# Altium schematic sheet MercurialSDR_FPGA_BNK.SchDoc: MercurialSDR - iCE Banks
size A4; Author: Andres Hojnadel; DrawnBy: Andres Hojnadel; Revision: Rev2.0; SheetNumber: 5; SheetTotal: 6; ProjectName: MercurialSDR
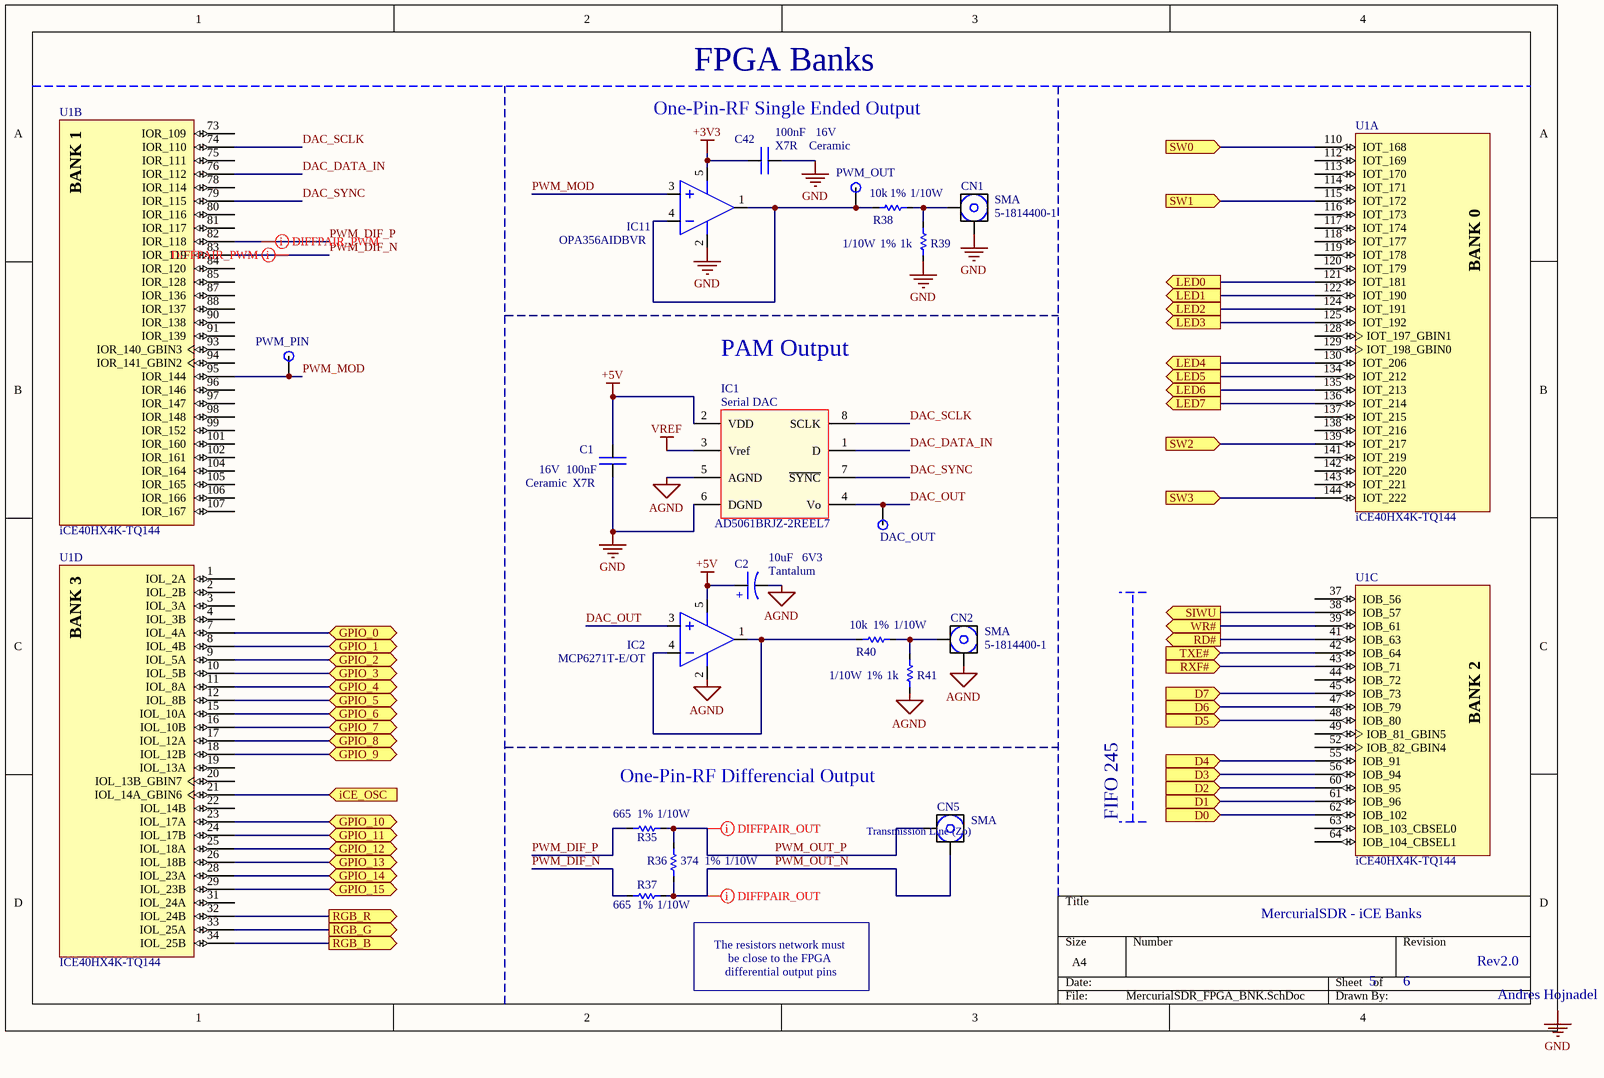
[diagram p0: MercurialSDR_FPGA_BNK.SchDoc]

## Parts
C1  value 100nF  Temp Coef: X7R  VR: 16V  Material: Ceramic  [CAP_0603]  (hidden comment: Capacitor)
C2  value 10uF  VR: 6V3  Material: Tantalum  [CAP_TANT_1206]  (hidden comment: Capacitor Polarizado)
C42  value 100nF  Temp Coef: X7R  VR: 16V  Material: Ceramic  [CAP_0603]  (hidden comment: Capacitor)
CN1  SMA  Part Number: 5-1814400-1  [SMA_Connector]
CN2  SMA  Part Number: 5-1814400-1  [SMA_Connector]
CN5  SMA  [SMA_Connector]
IC1  Serial DAC  Part Number: AD5061BRJZ-2REEL7  [SOT-23-8]
IC2  Part Number: MCP6271T-E/OT  [SOT-23-5]  (hidden comment: OPAMP)
IC11  Part Number: OPA356AIDBVR  [SOT-23-5_2]  (hidden comment: OPAMP)
R35  value 665  Power: 1/10W  Tolerance: 1%  [RES_0603]  (hidden comment: Resistor SMD)
R36  value 374  Power: 1/10W  Tolerance: 1%  [RES_0603]  (hidden comment: Resistor SMD)
R37  value 665  Power: 1/10W  Tolerance: 1%  [RES_0603]  (hidden comment: Resistor SMD)
R38  value 10k  Power: 1/10W  Tolerance: 1%  [RES_0603]  (hidden comment: Resistor SMD)
R39  value 1k  Power: 1/10W  Tolerance: 1%  [RES_0603]  (hidden comment: Resistor SMD)
R40  value 10k  Power: 1/10W  Tolerance: 1%  [RES_0603]  (hidden comment: Resistor SMD)
R41  value 1k  Power: 1/10W  Tolerance: 1%  [RES_0603]  (hidden comment: Resistor SMD)
TP1  TP Name: PWM_PIN  [TP_TOP]  (hidden comment: Test Point)
TP2  TP Name: DAC_OUT  [TP_TH]  (hidden comment: Test Point)
TP5  TP Name: PWM_OUT  [TP_TH]  (hidden comment: Test Point)
U1  iCE40HX4K-TQ144  [LATC-TQFP-144_L]  (parts A,B,C,D of 6)

## Ports
D0 (in), D1 (in), D2 (in), D3 (in), D4 (in), D5 (in), D6 (in), D7 (in), GPIO_0 (bidir), GPIO_1 (bidir), GPIO_2 (bidir), GPIO_3 (bidir), GPIO_4 (bidir), GPIO_5 (bidir), GPIO_6 (bidir), GPIO_7 (bidir), GPIO_8 (bidir), GPIO_9 (bidir), GPIO_10 (bidir), GPIO_11 (bidir), GPIO_12 (bidir), GPIO_13 (bidir), GPIO_14 (bidir), GPIO_15 (bidir), iCE_OSC (in), LED0 (out), LED1 (out), LED2 (out), LED3 (out), LED4 (out), LED5 (out), LED6 (out), LED7 (out), RD# (out), RGB_B (out), RGB_G (out), RGB_R (out), RXF# (in), SIWU (out), SW0 (in), SW1 (in), SW2 (in), SW3 (in), TXE# (in), WR# (out)

## Nets
+3V3: C42.2 IC11.5(VDD)
+5V: C1.1 C2.1 IC1.2(VDD) IC2.5(VDD)
AGND: C2.2 CN2.2(GND) IC1.5(AGND) IC2.2(Vss) R41.2
GND: C1.2 C42.1 CN1.2(GND) IC1.6(DGND) IC11.2(Vss) R39.2
VREF: IC1.3(Vref)
D0: U1.62(IOB_102) ; port D0
D1: U1.61(IOB_96) ; port D1
D2: U1.60(IOB_95) ; port D2
D3: U1.56(IOB_94) ; port D3
D4: U1.55(IOB_91) ; port D4
D5: U1.48(IOB_80) ; port D5
D6: U1.47(IOB_79) ; port D6
D7: U1.45(IOB_73) ; port D7
DAC_DATA_IN: IC1.1(D) U1.76(IOR_112)
DAC_OUT: IC1.4(Vo) IC2.3(V+) TP2.1(TP?)
DAC_SCLK: IC1.8(SCLK) U1.74(IOR_110)
DAC_SYNC: IC1.7(~{SYNC}) U1.79(IOR_115)
GPIO_0: U1.7(IOL_4A) ; port GPIO_0
GPIO_1: U1.8(IOL_4B) ; port GPIO_1
GPIO_2: U1.9(IOL_5A) ; port GPIO_2
GPIO_3: U1.10(IOL_5B) ; port GPIO_3
GPIO_4: U1.11(IOL_8A) ; port GPIO_4
GPIO_5: U1.12(IOL_8B) ; port GPIO_5
GPIO_6: U1.15(IOL_10A) ; port GPIO_6
GPIO_7: U1.16(IOL_10B) ; port GPIO_7
GPIO_8: U1.17(IOL_12A) ; port GPIO_8
GPIO_9: U1.18(IOL_12B) ; port GPIO_9
GPIO_10: U1.23(IOL_17A) ; port GPIO_10
GPIO_11: U1.24(IOL_17B) ; port GPIO_11
GPIO_12: U1.25(IOL_18A) ; port GPIO_12
GPIO_13: U1.26(IOL_18B) ; port GPIO_13
GPIO_14: U1.28(IOL_23A) ; port GPIO_14
GPIO_15: U1.29(IOL_23B) ; port GPIO_15
iCE_OSC: U1.21(IOL_14A_GBIN6) ; port iCE_OSC
LED0: U1.121(IOT_181) ; port LED0
LED1: U1.122(IOT_190) ; port LED1
LED2: U1.124(IOT_191) ; port LED2
LED3: U1.125(IOT_192) ; port LED3
LED4: U1.130(IOT_206) ; port LED4
LED5: U1.134(IOT_212) ; port LED5
LED6: U1.135(IOT_213) ; port LED6
LED7: U1.136(IOT_214) ; port LED7
PWM_DIF_N: R37.2 U1.83(IOR_119)
PWM_DIF_P: R35.2 U1.82(IOR_118)
PWM_MOD: IC11.3(V+) TP1.1(TP?) U1.95(IOR_144)
PWM_OUT_N: CN5.2(GND) R36.2 R37.1
PWM_OUT_P: CN5.1(Vin) R35.1 R36.1
RD#: U1.41(IOB_63) ; port RD#
RGB_B: U1.34(IOL_25B) ; port RGB_B
RGB_G: U1.33(IOL_25A) ; port RGB_G
RGB_R: U1.32(IOL_24B) ; port RGB_R
RXF#: U1.43(IOB_71) ; port RXF#
SIWU: U1.38(IOB_57) ; port SIWU
SW0: U1.110(IOT_168) ; port SW0
SW1: U1.115(IOT_172) ; port SW1
SW2: U1.139(IOT_217) ; port SW2
SW3: U1.144(IOT_222) ; port SW3
TXE#: U1.42(IOB_64) ; port TXE#
WR#: U1.39(IOB_61) ; port WR#
NetCN1_1: CN1.1(Vin) R38.2 R39.1
NetCN2_1: CN2.1(Vin) R40.2 R41.1
NetIC2_1: IC2.1(Vo) IC2.4(V-) R40.1
NetIC11_1: IC11.1(Vo) IC11.4(V-) R38.1 TP5.1(TP?)

Not connected (* = marked no-connect by the designer): U1 1(IOL_2A) 2(IOL_2B) 3(IOL_3A) 4(IOL_3B) 19(IOL_13A) 20(IOL_13B_GBIN7) 22(IOL_14B) 31(IOL_24A) 37(IOB_56) 44(IOB_72) 49(IOB_81_GBIN5) 52(IOB_82_GBIN4) 63(IOB_103_CBSEL0) 64(IOB_104_CBSEL1) 73(IOR_109) 75(IOR_111) 78(IOR_114) 80(IOR_116) 81(IOR_117) 84(IOR_120) 85(IOR_128) 87(IOR_136) 88(IOR_137) 90(IOR_138) 91(IOR_139) 93(IOR_140_GBIN3) 94(IOR_141_GBIN2) 96(IOR_146) 97(IOR_147) 98(IOR_148) 99(IOR_152) 101(IOR_160) 102(IOR_161) 104(IOR_164) 105(IOR_165) 106(IOR_166) 107(IOR_167) 112(IOT_169) 113(IOT_170) 114(IOT_171) 116(IOT_173) 117(IOT_174) 118(IOT_177) 119(IOT_178) 120(IOT_179) 128(IOT_197_GBIN1) 129(IOT_198_GBIN0) 137(IOT_215) 138(IOT_216) 141(IOT_219) 142(IOT_220) 143(IOT_221)

## Layout directives
differential pair: PWM_DIF_N, PWM_DIF_P, PWM_OUT_N, PWM_OUT_P

## Notes on the sheet
- One-Pin-RF Single Ended Output
- FPGA Banks
- PAM Output
- One-Pin-RF Differencial Output
- FIFO 245
- Transmission Line (Zo)
- The resistors network must
  be close to the FPGA
  differential output pins
- Labels drawn without touching a wire or pin: GND
- (in symbol Cap Pol) +
- (in symbol ICE40HX4K-TQ144, part A) BANK 0
- (in symbol ICE40HX4K-TQ144, part B) BANK 1
- (in symbol ICE40HX4K-TQ144, part C) BANK 2
- (in symbol ICE40HX4K-TQ144, part D) BANK 3

## Library data of the parts
C1 C42 = Cap: Capacitor no polarizado; Part Number: CL10B104KO8NNNC
C2 = Cap Pol: Part Number: TAJA106K006RNJ; Temp Coef: *
CN1 CN2 = SMA: Conector SMA
CN5 = SMA: Conector SMA; Part Number: 5-1814400-1
IC1 = AD5061: DAC SPI; Bits: 16; Settling Time: 4us; Communication: SPI
IC2 IC11 = OPAMP: Operational Amplifier
R35 R37 = Res: Resistor; Part Number: RC0603FR-07665RL
R36 = Res: Resistor; Part Number: RC0603FR-07374RL
R38 R40 = Res: Resistor; Part Number: CR0603-FX-1002EAS
R39 R41 = Res: Resistor; Part Number: CR0603-FX-1001ELF
U1 = ICE40HX4K-TQ144: iCE40 HX4K Series FPGA Family, 3520 Logic Cells, 1.2 V Core, 80 K Embedded RAM Bits, 144-pin TQFP, Pb-Free, Tray; Manufacturer: Lattice Semiconductor; Phase-Locked Loops: 2; Supply Voltage: 1.2V; Logic Cells: 3520; Embedded RAM Bits: 80K; ComponentLink1Description: Manufacturer URL; ComponentLink2Description: Datasheet; DatasheetVersion: Rev. 02.9; Mounting Technology: Surface Mount; ComponentLink3URL: http://www.latticesemi.com/lit/docs/package/pkg.pdf; ComponentLink3Description: Package Specification; ComponentLink1URL: http://www.latticesemi.com/en; ComponentLink2URL: http://www.latticesemi.com/~/media/Documents/DataSheets/iCE/iCE40LPHXFamilyDataSheet.pdf; PackageReference: TQFP-144; Packing: Tray; PartNumber: ICE40HX4K-TQ144; PackageDescription: 144-Pin Thin Quad Flat Package, Body 20 x 20 mm, Pitch 0.5 mm; PackageVersion: Rev. 03.9, 02/2013; RoHS: TRUE